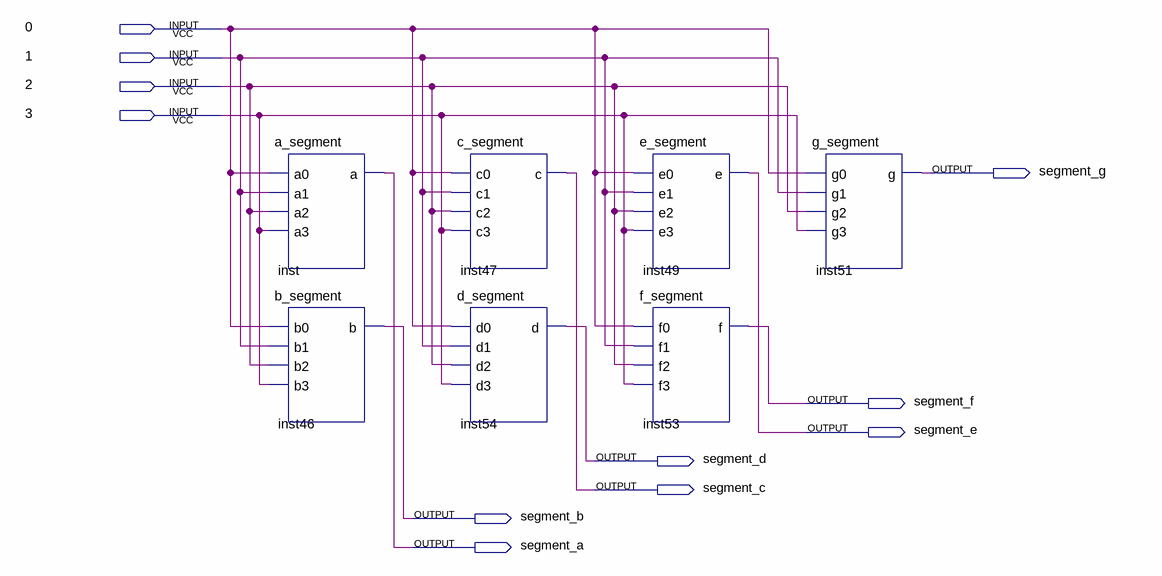
[diagram p0: schematic sheet]
// Quartus schematic project5.bdf as structural Verilog: 7 symbols, 11 pins
module project5 (
  input  \0 ,
  input  \1 ,
  input  \2 ,
  input  \3 ,
  output segment_g,
  output segment_f,
  output segment_e,
  output segment_d,
  output segment_c,
  output segment_b,
  output segment_a
);

  a_segment inst (.a0(\0 ), .a1(\1 ), .a2(\2 ), .a3(\3 ), .a(segment_a));
  b_segment inst46 (.b0(\0 ), .b1(\1 ), .b2(\2 ), .b3(\3 ), .b(segment_b));
  c_segment inst47 (.c0(\0 ), .c1(\1 ), .c2(\2 ), .c3(\3 ), .c(segment_c));
  d_segment inst54 (.d0(\0 ), .d1(\1 ), .d2(\2 ), .d3(\3 ), .d(segment_d));
  e_segment inst49 (.e0(\0 ), .e1(\1 ), .e2(\2 ), .e3(\3 ), .e(segment_e));
  f_segment inst53 (.f0(\0 ), .f1(\1 ), .f2(\2 ), .f3(\3 ), .f(segment_f));
  g_segment inst51 (.g0(\0 ), .g1(\1 ), .g2(\2 ), .g3(\3 ), .g(segment_g));
endmodule
